# EAGLE schematic expansion-original- (EAGLE 9.6.2)
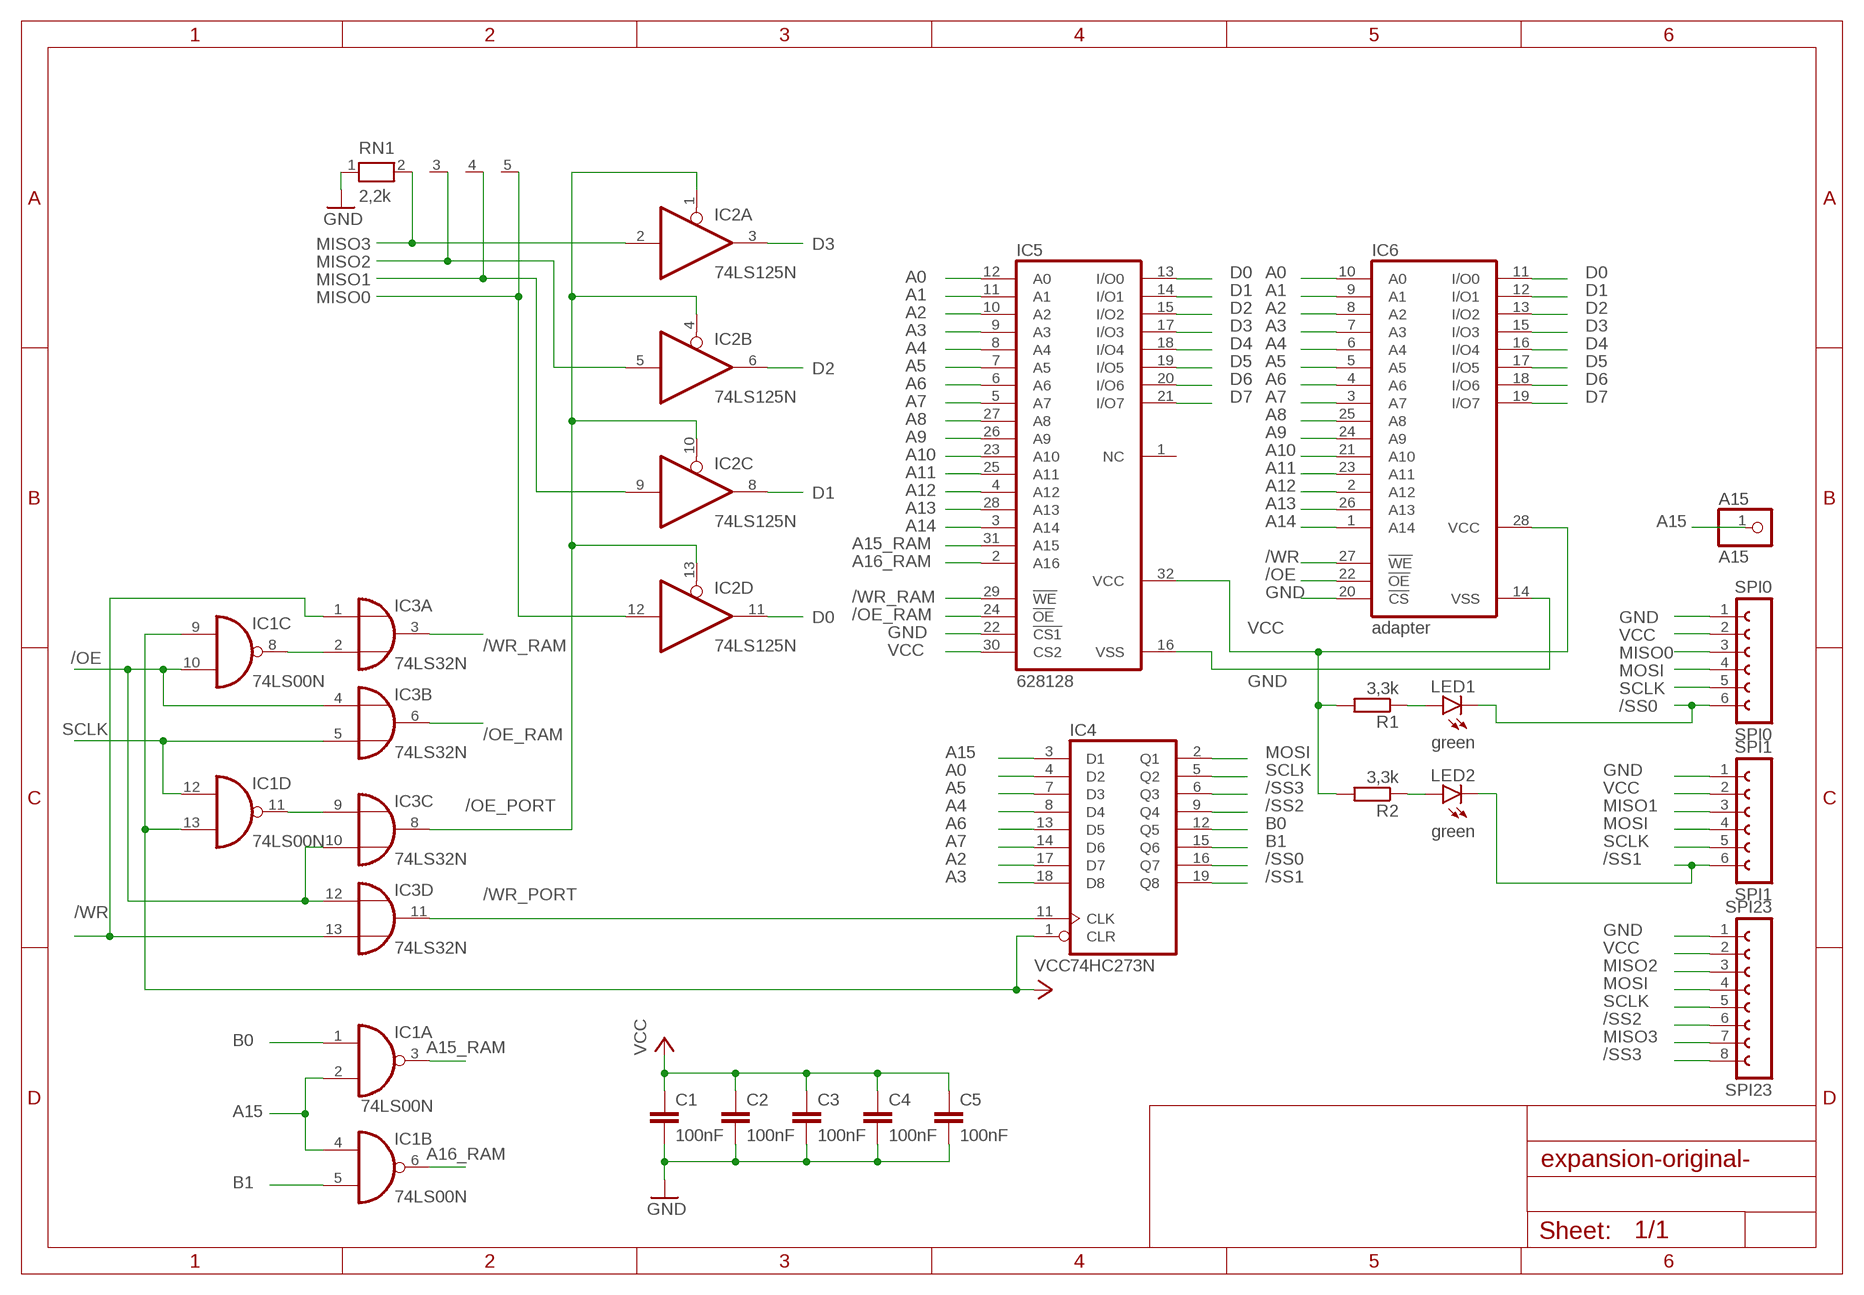
[diagram p0: schematic, sheet 1]

## Parts
A15  A15  PINHD-1X1  [1X01]
C1  100nF  C-EU050-024X044  [C050-024X044]
C2  100nF  C-EU050-024X044  [C050-024X044]
C3  100nF  C-EU050-024X044  [C050-024X044]
C4  100nF  C-EU050-024X044  [C050-024X044]
C5  100nF  C-EU050-024X044  [C050-024X044]
IC1  74LS00N  [DIL14]
IC2  74LS125N  [DIL14]
IC3  74LS32N  [DIL14]
IC4  74HC273N  [DIL20]
IC5  628128  628128P  [DIL32]
IC6  adapter  62256P  [DIL28-6]
LED1  green  LED3MM  [LED3MM]
LED2  green  LED3MM  [LED3MM]
R1  3,3k  R-EU_0207/10  [0207/10]
R2  3,3k  R-EU_0207/10  [0207/10]
RN1  2,2k  RN04  [RN-5]
SPI0  SPI0  FE06-1  [FE06]
SPI1  SPI1  FE06-1  [FE06]
SPI23  SPI23  FE08-1  [FE08]

## Nets
/OE: IC1.10(C:I1) IC3.4(B:I0) IC3.10(C:I1) IC3.12(D:I0) IC6.22(!OE)
/OE_PORT: IC2.1(A:OE) IC2.4(B:OE) IC2.10(C:OE) IC2.13(D:OE) IC3.8(C:O)
/OE_RAM: IC3.6(B:O) IC5.24(!OE)
/SS0: IC4.16(Q7) LED1.K(C) SPI0.6
/SS1: IC4.19(Q8) LED2.K(C) SPI1.6
/SS2: IC4.9(Q4) SPI23.6
/SS3: IC4.6(Q3) SPI23.8
/WR: IC3.1(A:I0) IC3.13(D:I1) IC6.27(!WE)
/WR_PORT: IC3.11(D:O) IC4.11(CLK)
/WR_RAM: IC3.3(A:O) IC5.29(!WE)
A0: IC4.4(D2) IC5.12(A0) IC6.10(A0)
A1: IC5.11(A1) IC6.9(A1)
A2: IC4.17(D7) IC5.10(A2) IC6.8(A2)
A3: IC4.18(D8) IC5.9(A3) IC6.7(A3)
A4: IC4.8(D4) IC5.8(A4) IC6.6(A4)
A5: IC4.7(D3) IC5.7(A5) IC6.5(A5)
A6: IC4.13(D5) IC5.6(A6) IC6.4(A6)
A7: IC4.14(D6) IC5.5(A7) IC6.3(A7)
A8: IC5.27(A8) IC6.25(A8)
A9: IC5.26(A9) IC6.24(A9)
A10: IC5.23(A10) IC6.21(A10)
A11: IC5.25(A11) IC6.23(A11)
A12: IC5.4(A12) IC6.2(A12)
A13: IC5.28(A13) IC6.26(A13)
A14: IC5.3(A14) IC6.1(A14)
A15: A15.1 IC1.2(A:I1) IC1.4(B:I0) IC4.3(D1)
A15_RAM: IC1.3(A:O) IC5.31(A15)
A16_RAM: IC1.6(B:O) IC5.2(A16)
B0: IC1.1(A:I0) IC4.12(Q5)
B1: IC1.5(B:I1) IC4.15(Q6)
D0: IC2.11(D:O) IC5.13(I/O0) IC6.11(I/O0)
D1: IC2.8(C:O) IC5.14(I/O1) IC6.12(I/O1)
D2: IC2.6(B:O) IC5.15(I/O2) IC6.13(I/O2)
D3: IC2.3(A:O) IC5.17(I/O3) IC6.15(I/O3)
D4: IC5.18(I/O4) IC6.16(I/O4)
D5: IC5.19(I/O5) IC6.17(I/O5)
D6: IC5.20(I/O6) IC6.18(I/O6)
D7: IC5.21(I/O7) IC6.19(I/O7)
GND [power]: C1.2 C2.2 C3.2 C4.2 C5.2 IC5.16(VSS) IC5.22(!CS1) IC6.14(VSS) IC6.20(!CS) RN1.1 SPI0.1 SPI1.1 SPI23.1
MISO0: IC2.12(D:I) RN1.5 SPI0.3
MISO1: IC2.9(C:I) RN1.4 SPI1.3
MISO2: IC2.5(B:I) RN1.3 SPI23.3
MISO3: IC2.2(A:I) RN1.2 SPI23.7
MOSI: IC4.2(Q1) SPI0.4 SPI1.4 SPI23.4
N$1: IC1.8(C:O) IC3.2(A:I1)
N$2: LED1.A R1.1
N$3: IC1.11(D:O) IC3.9(C:I0)
N$4: LED2.A R2.1
SCLK: IC1.12(D:I0) IC3.5(B:I1) IC4.5(Q2) SPI0.5 SPI1.5 SPI23.5
VCC [power]: C1.1 C2.1 C3.1 C4.1 C5.1 IC1.9(C:I0) IC1.13(D:I1) IC4.1(CLR) IC5.30(CS2) IC5.32(VCC) IC6.28(VCC) R1.2 R2.2 SPI0.2 SPI1.2 SPI23.2
Unconnected: IC5.1(NC)

## Power pins joined to a net without a drawn wire
GND: IC1.7(P:GND) IC2.7(P:GND) IC3.7(P:GND) IC4.10(GND)
VCC: IC1.14(P:VCC) IC2.14(P:VCC) IC3.14(P:VCC) IC4.20(VCC)

## Library data of the parts
A15 = pinhead:PINHD-1X1: PIN HEADER
C1-C5 = rcl:C-EU: CAPACITOR, European symbol; SPICEPREFIX: C
IC1 = 74xx-eu:74*00: Quad 2-input NAND gate
IC2 = 74xx-eu:74*125: Quad bus BUFFER, 3-state
IC3 = 74xx-eu:74*32: Quad 2-input OR gate
IC4 = 74xx-eu:74*273: Octal D type FLIP FLOP, clear
IC5 = memory-hitachi:628128P: MEMORY; OC_FARNELL: unknown; OC_NEWARK: unknown
IC6 = memory-hitachi:62256P: MEMORY; OC_FARNELL: unknown; OC_NEWARK: unknown
LED1 LED2 = led:LED: LED OSRAM: - CHIPLED LG R971, LG N971, LY N971, LG Q971, LY Q971, LO R971, LY R971 LH N974, LH R974 LS Q976, LO Q976, LY Q976 LO Q996 - Hyper CHIPLED LW Q18S LB Q993, LB Q99A, LB R99A - SideLED LS A670, LO A670, LY A670, LG A670, LP A670 LB A673, LV A673, LT A673, LW A673 LH A674 LY A675 LS A676, LA A676, LO A676, LY A676, LW A676 LS A679, LY A679, LG A679 - Hyper Micro SIDELED® LS Y876, LA Y876, LO Y876, LY Y876 LT Y87S - SmartLED LW L88C, LW L88S LB L89C, LB L89S, LG L890 LS L89K, LO L89K, LY L89K LS L896, LA L896, LO L896, LY L896 - TOPLED LS T670, LO T670, LY T670, LG T670, LP T670 LSG T670, LSP T670, LSY T670, LOP T670, LYG T670 LG T671, LOG T671, LSG T671 LB T673, LV T673, LT T673, LW T673 LH T674 LS T676, LA T676, LO T676, LY T676, LB T676, LH T676, LSB T676, LW T676 LB T67C, LV T67C, LT T67C, LS T67K, LO T67K, LY T67K, LW E67C LS E67B, LA E67B, LO E67B, LY E67B, LB E67C, LV E67C, LT E67C LW T67C LS T679, LY T679, LG T679 LS T770, LO T770, LY T770, LG T770, LP T770 LB T773, LV T773, LT T773, LW T773 LH T774 LS E675, LA E675, LY E675, LS T675 LS T776, LA T776, LO T776, LY T776, LB T776 LHGB T686 LT T68C, LB T68C - Hyper Mini TOPLED® LB M676 - Mini TOPLED Santana® LG M470 LS M47K, LO M47K, LY M47K Source: http://www.osram.convergy.de LUXEON: - LUMILED® LXK2-PW12-R00, LXK2-PW12-S00, LXK2-PW14-U00, LXK2-PW14-V00 LXK2-PM12-R00, LXK2-PM12-S00, LXK2-PM14-U00 LXK2-PE12-Q00, LXK2-PE12-R00, LXK2-PE12-S00, LXK2-PE14-T00, LXK2-PE14-U00 LXK2-PB12-K00, LXK2-PB12-L00, LXK2-PB12-M00, LXK2-PB14-N00, LXK2-PB14-P00, LXK2-PB14-Q00 LXK2-PR12-L00, LXK2-PR12-M00, LXK2-PR14-Q00, LXK2-PR14-R00 LXK2-PD12-Q00, LXK2-PD12-R00, LXK2-PD12-S00 LXK2-PH12-R00, LXK2-PH12-S00 LXK2-PL12-P00, LXK2-PL12-Q00, LXK2-PL12-R00 Source: www.luxeon.com KINGBRIGHT: KA-3528ASYC Source: www.kingbright.com
R1 R2 = rcl:R-EU_: RESISTOR, European symbol; SPICEPREFIX: R
RN1 = resistor-net:RN04: RESISTOR NETWORK; OC_FARNELL: unknown; OC_NEWARK: unknown
SPI0 SPI1 = con-lsta:FE06-1: FEMALE HEADER; OC_FARNELL: unknown; OC_NEWARK: unknown
SPI23 = con-lsta:FE08-1: FEMALE HEADER; OC_FARNELL: unknown; OC_NEWARK: unknown

## Net classes
1 power: width 0.406 mm, clearance 0.203 mm